# Altium project ESC_Project.PrjPcb
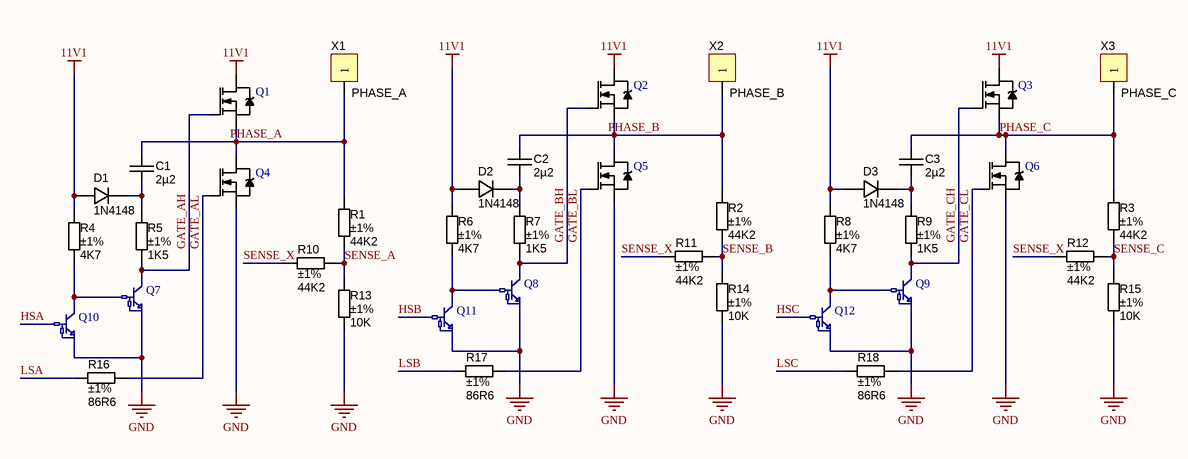
[diagram p0: ESC_Schematic_0.SchDoc]
2 sheets, 71 parts. Net scope: global (net labels, ports and power ports of the same name join across sheets).
Board file: ESC_PCB_0.PcbDoc
Sheets:
  ESC_Schematic_0.SchDoc
  ESC_Schematic_1.SchDoc

## Sheet ESC_Schematic_0.SchDoc
size A

### Parts
C1  value 2µ2  [CAPC2012X135N]  (hidden comment: approved sub OK)
C2  value 2µ2  [CAPC2012X135N]  (hidden comment: approved sub OK)
C3  value 2µ2  [CAPC2012X135N]  (hidden comment: approved sub OK)
D1  1N4148  [SOD523F]
D2  1N4148  [SOD523F]
D3  1N4148  [SOD523F]
Q1  *  [TO-252_1]  (value not drawn)
Q2  *  [TO-252_1]  (value not drawn)
Q3  *  [TO-252_1]  (value not drawn)
Q4  *  [TO-252_1]  (value not drawn)
Q5  *  [TO-252_1]  (value not drawn)
Q6  *  [TO-252_1]  (value not drawn)
Q7  *  [TO-236]  (value not drawn)
Q8  *  [TO-236]  (value not drawn)
Q9  *  [TO-236]  (value not drawn)
Q10  *  [TO-236]  (value not drawn)
Q11  *  [TO-236]  (value not drawn)
Q12  *  [TO-236]  (value not drawn)
R1  value 44K2  Tolerance: ±1%  [RESC2012X70N]  (hidden comment: Thick Film)
R2  value 44K2  Tolerance: ±1%  [RESC2012X70N]  (hidden comment: Thick Film)
R3  value 44K2  Tolerance: ±1%  [RESC2012X70N]  (hidden comment: Thick Film)
R4  value 4K7  Tolerance: ±1%  [RESC2012X70N]  (hidden comment: Thick Film)
R5  value 1K5  Tolerance: ±1%  [RESC2012X70N]  (hidden comment: Thick Film)
R6  value 4K7  Tolerance: ±1%  [RESC2012X70N]  (hidden comment: Thick Film)
R7  value 1K5  Tolerance: ±1%  [RESC2012X70N]  (hidden comment: Thick Film)
R8  value 4K7  Tolerance: ±1%  [RESC2012X70N]  (hidden comment: Thick Film)
R9  value 1K5  Tolerance: ±1%  [RESC2012X70N]  (hidden comment: Thick Film)
R10  value 44K2  Tolerance: ±1%  [RESC2012X70N]  (hidden comment: Thick Film)
R11  value 44K2  Tolerance: ±1%  [RESC2012X70N]  (hidden comment: Thick Film)
R12  value 44K2  Tolerance: ±1%  [RESC2012X70N]  (hidden comment: Thick Film)
R13  value 10K  Tolerance: ±1%  [RESC2012X70N]  (hidden comment: Thick Film)
R14  value 10K  Tolerance: ±1%  [RESC2012X70N]  (hidden comment: Thick Film)
R15  value 10K  Tolerance: ±1%  [RESC2012X70N]  (hidden comment: Thick Film)
R16  value 86R6  Tolerance: ±1%  [RESC2012X70N]  (hidden comment: Thick Film)
R17  value 86R6  Tolerance: ±1%  [RESC2012X70N]  (hidden comment: Thick Film)
R18  value 86R6  Tolerance: ±1%  [RESC2012X70N]  (hidden comment: Thick Film)
X1  PHASE_A  [THP_D38_T75_B125]  (no BOM)
X2  PHASE_B  [THP_D38_T75_B125]  (no BOM)
X3  PHASE_C  [THP_D38_T75_B125]  (no BOM)

### Nets
11V1: D1.A D2.A D3.A Q1.3(D) Q2.3(D) Q3.3(D) R4.1 R6.1 R8.1
GND: Q4.2(S) Q5.2(S) Q6.2(S) Q7.2(E) Q8.2(E) Q9.2(E) Q10.2(E) Q11.2(E) Q12.2(E) R13.2 R14.2 R15.2
GATE_AH: Q1.1(G) Q7.3(C) R5.2
GATE_AL: Q4.1(G) R16.2
GATE_BH: Q2.1(G) Q8.3(C) R7.2
GATE_BL: Q5.1(G) R17.2
GATE_CH: Q3.1(G) Q9.3(C) R9.2
GATE_CL: Q6.1(G) R18.2
HSA: Q10.1(B)
HSB: Q11.1(B)
HSC: Q12.1(B)
LSA: R16.1
LSB: R17.1
LSC: R18.1
PHASE_A: C1.1 Q1.2(S) Q4.3(D) R1.1 X1.1
PHASE_B: C2.1 Q2.2(S) Q5.3(D) R2.1 X2.1
PHASE_C: C3.1 Q3.2(S) Q6.3(D) R3.1 X3.1
SENSE_A: R1.2 R10.2 R13.1
SENSE_B: R2.2 R11.2 R14.1
SENSE_C: R3.2 R12.2 R15.1
SENSE_X: R10.1 R11.1 R12.1
NetC1_2: C1.2 D1.K R5.1
NetC2_2: C2.2 D2.K R7.1
NetC3_2: C3.2 D3.K R9.1
NetQ7_1: Q7.1(B) Q10.3(C) R4.2
NetQ8_1: Q8.1(B) Q11.3(C) R6.2
NetQ9_1: Q9.1(B) Q12.3(C) R8.2

### Library data of the parts
C1-C3 = CAPC_2u2_0805: Capacitor SMD Cer 2.2uF 10% 16V X7R 0805; Manufacturer 1: Kemet; Manufacturer Part Number 1: C0805C225K4RACTU; Ratings: 16V; X7R; SCDType: undef; Supplier 1: Digi-Key; Supplier Part Number 1: 399-3523-1-ND; Tolerance: ±10%; Package / Case: 0805 (2012 metric)
D1-D3 = DIODE_1N4148_200mA_SOD523F: Diode SMD small signal 0.2A SOD-523F; Manufacturer 1: Fairchild Semiconductor; Manufacturer Part Number 1: 1N4148WT; Ratings: Vr=75V; Vf=1V@10mA; Io=200mA; Material: Si; SCDType: source; Package / Case: SC-79, SOD-523F; Supplier 1: Digi-Key; Supplier Part Number 1: 1N4148WTCT-ND; ComponentLink1URL: http://www.fairchildsemi.com/ds/1N/1N914BWT.pdf; ComponentLink1Description: http://www.fairchildsemi.com/ds/1N/1N914BWT.pdf; Value: 1N4148
Q1-Q6 = PHD82N: PHD82N N-Channel MOSFET transistor
Q7-Q12 = PDTC143Z: NPN Resistor-Equipped Transistor (RET)
R1-R3 R10-R12 = RES_44K2_0805_1%: Resistor SMD chip 44.2k Ohm 0.125W 1% 0805; Manufacturer 1: Vishay/Dale; Manufacturer Part Number 1: CRCW080544K2FKEA; Ratings: 1/8W; SCDType: spec; Package / Case: 0805 (2012 metric); Supplier 1: Digi-Key; Supplier Part Number 1: 541-44.2KCCT-ND
R4 R6 R8 = RES_4K7_0805_1%: Resistor SMD chip 4.7k Ohm 0.125W 1% 0805; Manufacturer 1: Vishay/Dale; Manufacturer Part Number 1: CRCW08054K70FKEA; Ratings: 1/8W; SCDType: spec; Package / Case: 0805 (2012 metric); Supplier 1: Digi-Key; Supplier Part Number 1: 541-4.70KCCT-ND
R5 R7 R9 = RES_1K5_0805_1%: Resistor SMD chip 1.5k Ohm 0.125W 1% 0805; Manufacturer 1: Vishay/Dale; Manufacturer Part Number 1: CRCW08051K50FKEA; Ratings: 1/8W; SCDType: spec; Package / Case: 0805 (2012 metric); Supplier 1: Digi-Key; Supplier Part Number 1: 541-1.50KCCT-ND
R13-R15 = RES_10K_0805_1%: Resistor SMD chip 10k Ohm 0.125W 1% 0805; Manufacturer 1: Vishay/Dale; Manufacturer Part Number 1: CRCW080510K0FKEA; Ratings: 1/8W; SCDType: spec; Package / Case: 0805 (2012 metric); Supplier 1: Digi-Key; Supplier Part Number 1: 541-10.0KCCT-ND; Material: Thick Film
R16-R18 = RES_86R6_0805_1%: Resistor SMD chip 86.6 Ohm 0.125W 1% 0805; Manufacturer: Vishay/Dale; Manufacturer Part Number: CRCW080586R6FKEA; Ratings: 1/8W; SCDType: spec; Package / Case: 0805 (2012 metric); Supplier 1: Digi-Key; Supplier Part Number 1: 541-86.6CCT-ND
X1-X3 = Term1

## Sheet ESC_Schematic_1.SchDoc
size A
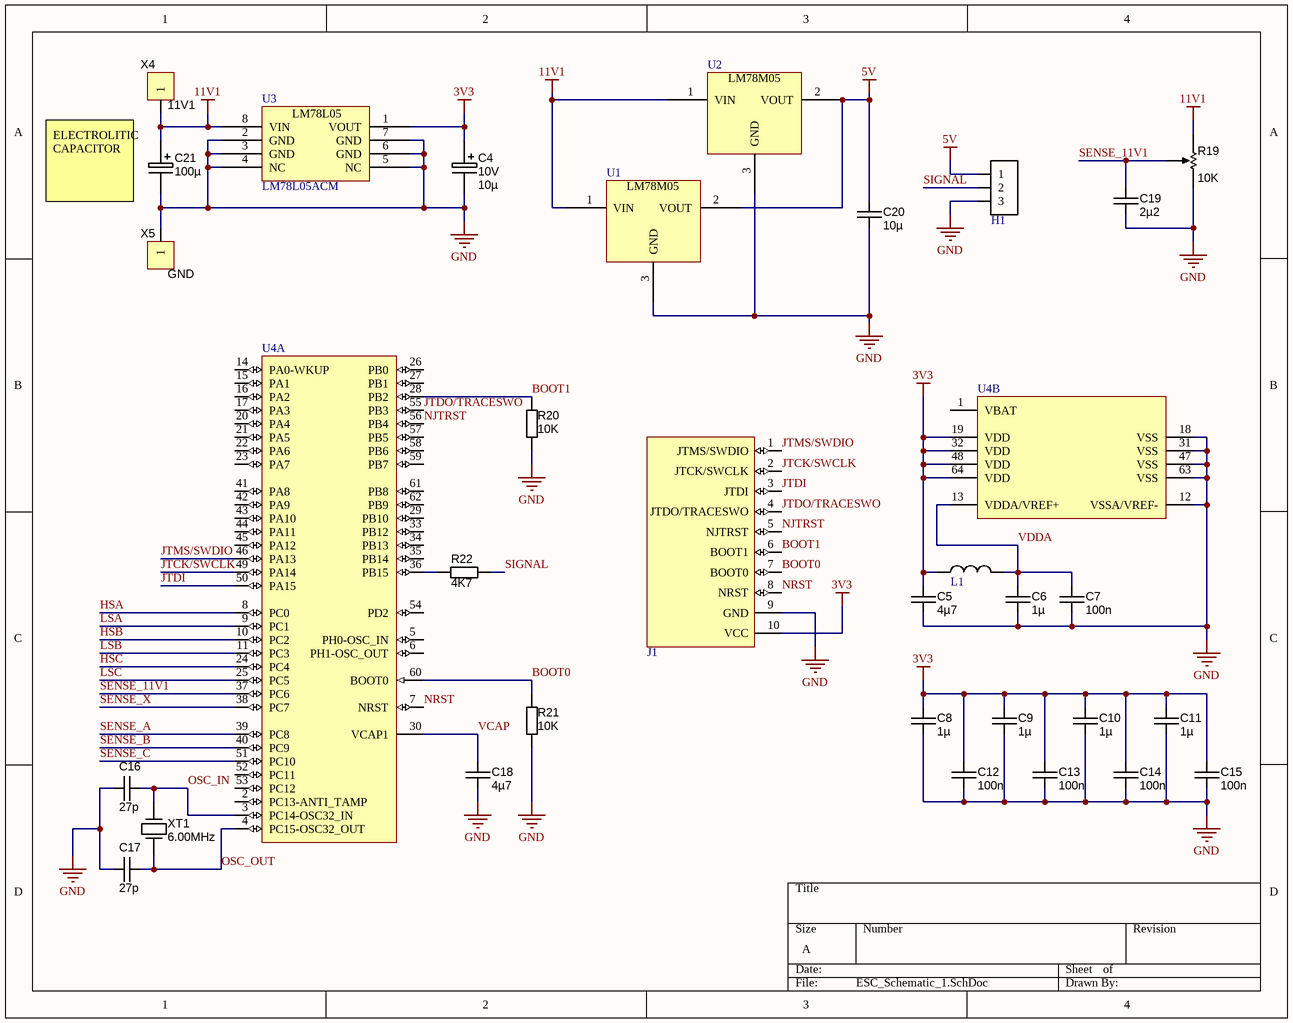
[diagram p1: ESC_Schematic_1.SchDoc]

### Parts
C4  Ratings: 10V  [CAPMP2012X150USR]  (hidden comment: 10µ)
C5  value 4µ7  [CAPC2012X135N]  (hidden comment: approved sub OK)
C6  value 1µ  [CAPC2012X135N]  (hidden comment: approved sub OK)
C7  value 100n  [CAPC2012X135N]  (hidden comment: approved sub OK)
C8  value 1µ  [CAPC2012X135N]  (hidden comment: approved sub OK)
C9  value 1µ  [CAPC2012X135N]  (hidden comment: approved sub OK)
C10  value 1µ  [CAPC2012X135N]  (hidden comment: approved sub OK)
C11  value 1µ  [CAPC2012X135N]  (hidden comment: approved sub OK)
C12  value 100n  [CAPC2012X135N]  (hidden comment: approved sub OK)
C13  value 100n  [CAPC2012X135N]  (hidden comment: approved sub OK)
C14  value 100n  [CAPC2012X135N]  (hidden comment: approved sub OK)
C15  value 100n  [CAPC2012X135N]  (hidden comment: approved sub OK)
C16  value 27p  [CAPC2012X135N]  (hidden comment: approved sub OK)
C17  value 27p  [CAPC2012X135N]  (hidden comment: approved sub OK)
C18  value 4µ7  [CAPC2012X135N]  (hidden comment: approved sub OK)
C19  value 2µ2  [CAPC2012X135N]  (hidden comment: approved sub OK)
C20  value 10µ  [CAPC2012X135N]  (hidden comment: approved sub OK)
C21  100µ  [CAPAE200P550X1200_FLAT2]
H1  *  [HDR_1x3]  (value not drawn)
J1  *  [SWJ-DP connector]  (value not drawn)
L1  *  [INDUCTOR]  (value not drawn)
R19  value 10K  [TrimPot_SMD_Bourns_3214G]  (hidden comment: 5 Turn)
R20  value 10K  [RESC2012X70N]  (hidden comment: Thick Film)
R21  value 10K  [RESC2012X70N]  (hidden comment: Thick Film)
R22  value 4K7  [RESC2012X70N]  (hidden comment: Thick Film)
U1  *  [TO-252]  (value not drawn)
U2  *  [TO-252]  (value not drawn)
U3  LM78L05ACM  [SOIC_8]
U4  (no value)  [STM-LQFP64_N]  (parts A,B of 2)
X4  11V1  [THP_D38_T75_B125]  (no BOM)
X5  GND  [THP_D38_T75_B125]  (no BOM)
XT1  6.00MHz  [CRYSTAL_HC49-US-SM]

### Nets
3V3: C4.1 C5.1 C8.1 C9.1 C10.1 C11.1 C12.1 C13.1 C14.1 C15.1 J1.10(VCC) L1.1 U3.1(VOUT) U4.19(VDD) U4.32(VDD) U4.48(VDD) U4.64(VDD)
5V: C20.1 H1.1 U1.2(VOUT) U2.2(VOUT)
11V1: C21.1 R19.1(CCW) U1.1(VIN) U2.1(VIN) U3.8(VIN) X4.1
GND: C4.2 C5.2 C6.2 C7.2 C8.2 C9.2 C10.2 C11.2 C12.2 C13.2 C14.2 C15.2 C16.1 C17.1 C18.2 C19.2 C20.2 C21.2 H1.3 J1.9(GND) R19.3(CW) R20.2 R21.2 U1.3(GND) U2.3(GND) U3.2(GND) U3.3(GND) U3.4(NC) U3.5(NC) U3.6(GND) U3.7(GND) U4.12(VSSA/VREF-) U4.18(VSS) U4.31(VSS) U4.47(VSS) U4.63(VSS) X5.1
BOOT0: J1.7(BOOT0) R21.1 U4.60(BOOT0)
BOOT1: J1.6(BOOT1) R20.1 U4.28(PB2)
HSA: U4.8(PC0)
HSB: U4.10(PC2)
HSC: U4.24(PC4)
JTCK/SWCLK: J1.2(JTCK/SWCLK) U4.49(PA14)
JTDI: J1.3(JTDI) U4.50(PA15)
JTDO/TRACESWO: J1.4(JTDO/TRACESWO) U4.55(PB3)
JTMS/SWDIO: J1.1(JTMS/SWDIO) U4.46(PA13)
LSA: U4.9(PC1)
LSB: U4.11(PC3)
LSC: U4.25(PC5)
NJTRST: J1.5(NJTRST) U4.56(PB4)
NRST: J1.8(NRST) U4.7(NRST)
OSC_IN: C16.2 U4.3(PC14-OSC32_IN) XT1.2(OUT)
OSC_OUT: C17.2 U4.4(PC15-OSC32_OUT) XT1.1(IN)
SENSE_11V1: C19.1 R19.2(WIPER) U4.37(PC6)
SENSE_A: U4.39(PC8)
SENSE_B: U4.40(PC9)
SENSE_C: U4.51(PC10)
SENSE_X: U4.38(PC7)
SIGNAL: H1.2 R22.2
VCAP: C18.1 U4.30(VCAP1)
VDDA: C6.1 C7.1 L1.2 U4.13(VDDA/VREF+)
NetR22_1: R22.1 U4.36(PB15)

Not connected (* = marked no-connect by the designer): U4 1(VBAT) 2(PC13-ANTI_TAMP) 5(PH0-OSC_IN) 6(PH1-OSC_OUT) 14(PA0-WKUP) 15(PA1) 16(PA2) 17(PA3) 20(PA4) 21(PA5) 22(PA6) 23(PA7) 26(PB0) 27(PB1) 29(PB10) 33(PB12) 34(PB13) 35(PB14) 41(PA8) 42(PA9) 43(PA10) 44(PA11) 45(PA12) 52(PC11) 53(PC12) 54(PD2) 57(PB5) 58(PB6) 59(PB7) 61(PB8) 62(PB9)

### Notes on the sheet
- ELECTROLITIC CAPACITOR
- (in symbol LM78L05ACM) LM78L05
- (in symbol LM78M05CDT) LM78M05

### Library data of the parts
C4 = CAPT_10u_0805_10V: Capacitor SMD Tantalum 10uF 20% 10V 0805; Manufacturer 1: AVX Corporation; Manufacturer Part Number 1: TAJP106M010RNJ; SCDType: spec; Package / Case: 0805 (2012 metric); Tolerance: ±20%; Material: Tantalum; Supplier 1: Digi-Key; Supplier Part Number 1: 478-3281-1-ND; Value: 10µ
C5 C18 = CAPC_4u7_0805: Capacitor SMD Cer 4.7uF 10% 16V X5R 0805; Manufacturer 1: Taiyo Yuden; Manufacturer Part Number 1: EMK212BJ475KG-T; Ratings: 16V; X5R; Material: ceramic; SCDType: spec; Package / Case: 0805 (2012 Metric); Tolerance: ±10%; Supplier 1: Digi-Key; Supplier Part Number 1: 587-1294-1-ND; Operating Temperature: -55°C ~ 85°C; Size / Dimension: 0.079" L x 0.049" W (2.00mm x 1.25mm); Thickness (Max): 0.053" (1.35mm); ComponentLink1URL: http://www.yuden.co.jp/productdata/catalog/en/mlcc01_e.pdf; ComponentLink1Description: http://www.yuden.co.jp/productdata/catalog/en/mlcc01_e.pdf; Supplier 2: Digi-Key; Supplier Part Number 2: 1276-1065-1-ND; Manufacturer 2: Samsung Electro-Mechanics America, Inc; Manufacturer Part Number 2: CL21A475KOFNNNE; RoHS 2: RoHS Compliant; ComponentLink2URL: http://www.samsungsem.com/servlet/FileDownload?type=spec&file=CL21A475KOFNNNE.pdf; ComponentLink2Description: http://www.samsungsem.com/servlet/FileDownload?type=spec&file=CL21A475KOFNNNE.pdf; Supplier 3: Digi-Key; Supplier Part Number 3: 399-8101-1-ND; Manufacturer 3: Kemet; Manufacturer Part Number 3: C0805C475K4PACTU; RoHS 3: RoHS Compliant; ComponentLink3URL: http://capacitoredge.kemet.com/capedge2/DataSheet?pn=C0805C475K4PACTU; ComponentLink3Description: http://capacitoredge.kemet.com/capedge2/DataSheet?pn=C0805C475K4PACTU; Supplier 4: Digi-Key; Supplier Part Number 4: 490-7215-1-ND; Manufacturer 4: Murata Electronics North America; Manufacturer Part Number 4: GRM21BR61C475MA88L; RoHS 4: RoHS Compliant; ComponentLink4URL: http://psearch.murata.com/capacitor/product/GRM21BR61C475MA88#.pdf; ComponentLink4Description: http://psearch.murata.com/capacitor/product/GRM21BR61C475MA88#.pdf; Supplier 5: Digi-Key; Supplier Part Number 5: 445-7640-1-ND; Manufacturer 5: TDK Corporation; Manufacturer Part Number 5: C2012X5R1C475K125AC; RoHS 5: RoHS Compliant; ComponentLink5URL: http://product.tdk.com/capacitor/mlcc/en/documents/mlcc_commercial_general_en.pdf; ComponentLink5Description: http://product.tdk.com/capacitor/mlcc/en/documents/mlcc_commercial_general_en.pdf; RoHS 1: RoHS Compliant
C6 C8-C11 = CAPC_1u_0805_X7R_16V_10%: Capacitor SMD Cer 1uF 10% 16V X7R 0805; Manufacturer 1: Yageo; Manufacturer Part Number 1: CC0805KKX7R7BB105; Ratings: 16V; X7R; Material: ceramic; SCDType: spec; Package / Case: 0805 (2012 metric); Tolerance: ±10%; Supplier 1: Digi-Key; Supplier Part Number 1: 311-1365-6-ND; RoHS 1: RoHS Compliant; Temperature Coefficient: X7R; ComponentLink1URL: http://www.yageo.com/documents/recent/UPY-GPHC_X7R_6.3V-to-50V_8.pdf; ComponentLink1Description: http://www.yageo.com/documents/recent/UPY-GPHC_X7R_6.3V-to-50V_8.pdf; Supplier 2: Digi-Key; Supplier Part Number 2: 399-1284-6-ND; Manufacturer 2: Kemet; Manufacturer Part Number 2: C0805C105K4RACTU; RoHS 2: RoHS Compliant; ComponentLink2URL: http://www.kemet.com/datasheets&C0805C105K4RACTU; ComponentLink2Description: http://www.kemet.com/datasheets&C0805C105K4RACTU; Supplier 3: Digi-Key; Supplier Part Number 3: 1276-1026-6-ND; Manufacturer 3: Samsung Electro-Mechanics America, Inc; Manufacturer Part Number 3: CL21B105KOFNNNE; RoHS 3: RoHS Compliant; ComponentLink3URL: http://www.samsungsem.com/servlet/FileDownload?type=spec&file=CL21B105KOFNNNE.pdf; ComponentLink3Description: http://www.samsungsem.com/servlet/FileDownload?type=spec&file=CL21B105KOFNNNE.pdf; Supplier 4: Digi-Key; Supplier Part Number 4: 445-1358-6-ND; Manufacturer 4: TDK Corporation; Manufacturer Part Number 4: C2012X7R1C105K125AA; RoHS 4: RoHS Compliant; ComponentLink4URL: http://product.tdk.com/capacitor/mlcc/en/documents/mlcc_commercial_general_en.pdf; ComponentLink4Description: http://product.tdk.com/capacitor/mlcc/en/documents/mlcc_commercial_general_en.pdf
C7 C12-C15 = CAPC_100n_0805_X7R_50V_10%: Capacitor SMD Cer 100nF 10% 50V X7R 0805; Manufacturer 1: Kemet; Manufacturer Part Number 1: C0805C104K5RACTU; Ratings: 50V; X7R; Material: ceramic; SCDType: undef; Package / Case: 0805 (2012 metric); Tolerance: ±10%; Supplier 1: Digi-Key; Supplier Part Number 1: 399-1170-1-ND
C16 C17 = CAPC_27p_0805_NP0_50V_5%: Capacitor SMD Cer 27pF 5% 50V NP0 0805; Manufacturer 1: Panasonic - ECG; Manufacturer Part Number 1: ECJ-2VC1H270J; Ratings: 50V; NP0; SCDType: undef; Tolerance: ±5%; Operating Temperature: -55°C ~ 125°C; Package / Case: 0805 (2012 metric); Supplier 1: Digi-Key; Supplier Part Number 1: PCC270CGCT-ND
C19 = CAPC_2u2_0805: as C1 on sheet ESC_Schematic_0; Supplier 1: Digi-Key; Supplier Part Number 1: 399-3523-1-ND; Tolerance: ±10%; Package / Case: 0805 (2012 metric)
C20 = CAPC_10u_0805_16V: Capacitor SMD Cer 10uF 10% 16V X7R 0805; Manufacturer 1: Samsung; Manufacturer Part Number 1: CL21B106KBN; Ratings: 16V; X7R; Material: ceramic; SCDType: undef; Package / Case: 0805 (2012 metric); Tolerance: ±10%
C21 = CAPE_100u_16V_THD: Capacitor THD Electrolytic 100uF 20% 16V Radial; Manufacturer: Panasonic - ECG; Manufacturer Part Number: ECA-1CM101; Material: Aluminum Electrolytic; SCDType: spec; Package / Case: Radial - Through hole; Ratings: 16V; Tolerance: ±20%; Supplier 1: Digi-Key; Supplier Part Number 1: P5138-ND; Value: 100µ
H1 = Header3P: Header, 2-pin
J1 = SWJ-Debug Port: 10 pin Serial Wire JTAG Debug Port
L1 = Inductor: 0603 Inductor
R19 = RES_TRIMMER_10K_5T_SMD: Trimmer SMD 10K 250mW 5-turn Side-adjust; Manufacturer 1: Bourns Inc.; Manufacturer Part Number 1: 3214G-1-103E; Tolerance: 10%; Ratings: 5 turn variable cermet; Number of Turns: 5; SCDType: spec; Supplier 1: Digi-Key; Supplier Part Number 1: 3214G-1-103ECT-ND
R20 R21 = RES_10K_0805_5%: Resistor SMD chip 10k Ohm 0.125W 5% 0805; Manufacturer 1: Yageo; Manufacturer Part Number 1: RC0805JR-0710KL; Ratings: 1/8 W; SCDType: spec; Package / Case: 0805 (2012 metric); Tolerance: ±5%; Material: Thick Film; Supplier 1: Digi-Key; Supplier Part Number 1: 311-10KARCT-ND
R22 = RES_4K7_0805_5%: Resistor SMD chip 4.7k Ohm 0.125W 5% 0805; Manufacturer 1: Yageo; Manufacturer Part Number 1: RC0805JR-074K7L; Ratings: 1/8 W; SCDType: spec; Package / Case: 0805 (2012 metric); Tolerance: ±5%; Material: Thick Film; Supplier 1: Digi-Key; Supplier Part Number 1: 311-4.7KARCT-ND
U1 U2 = LM78M05CDT: LM78L05
U3 = LM78L05ACM: 100-mA Fixed Output Linear Regulator
U4 = STM32F401RBT6: ARM Cortex-M4 32-bit MCU+FPU, 105 DMIPS, 128 kB Flash, 64 kB Internal RAM, 48 I/Os, 64-pin LQFP, -40 to 85 degC, Tray; Manufacturer: STMicroelectronics; FLASH Size (Prog) (kB): 128; I/Os (High Current): 48; Internal RAM Size (kB): 64; Operating Frequency(F) (Processor speed) (MHz): 84; Supply Voltage(Vcc) max (V): 3.6; Supply Voltage(Vcc) min (V): 1.8; DatasheetVersion: Rev. 1; PackageVersion: Rev. 4, 06/2013; PackageReference: LQFP64; PackageDescription: 64-Pin Low Profile Quad Flat Package, 10 x 10 mm Body, 0.5 mm Pitch; Supplier 1: Newark; Supplier Part Number 1: 19X6220; Supplier 2: Mouser; Supplier Part Number 2: 511-STM32F401RBT6; Core: ARM Cortex-M4; Packing: Tray; Mounting Technology: Surface Mount; PartNumber: STM32F401RBT6; ComponentLink1Description: Manufacturer URL; ComponentLink1URL: http://www.st.com/web/en/home.html; ComponentLink2Description: Datasheet; ComponentLink2URL: http://www.st.com/st-web-ui/static/active/en/resource/technical/document/data_brief/DM00071938.pdf; ComponentLink3Description: Package Specification; ComponentLink3URL: http://www.st.com/st-web-ui/static/active/en/resource/technical/document/datasheet/DM00037051.pdf
X4 X5 = Term1
XT1 = Crystal_6MHz_HC49/US: Resonator Ceramic 6.00 MHz 30ppm; Manufacturer 1: CTS-Frequency Controls; Manufacturer Part Number 1: ATS060BSM-1; Frequency: 6MHz; Frequency Stability: ±50ppm; Load Capacitance: 18pF; Operating Mode: Fundamental; Parameter Name: 0.169" (4.30mm); SCDType: spec; Package / Case: HC49/US-SM; Ratings: 6.00 MHz; Supplier 1: Digi-Key; Supplier Part Number 1: CTX882CT-ND; Type: MHz Crystal; Frequency Tolerance: ±30ppm; Operating Temperature: -20°C ~ 70°C; Mounting Type: Surface Mount; Size / Dimension: 0.437" L x 0.190" W (11.10mm x 4.83mm); ComponentLink1URL: http://www.ctscorp.com/components/Datasheets/008-0309-0.pdf; ComponentLink1Description: http://www.ctscorp.com/components/Datasheets/008-0309-0.pdf

## Nets that join several sheets
11V1: ESC_Schematic_0 (9 pins), ESC_Schematic_1 (6 pins)
GND: ESC_Schematic_0 (12 pins), ESC_Schematic_1 (37 pins)
HSA: ESC_Schematic_0 (Q10.1), ESC_Schematic_1 (U4.8)
HSB: ESC_Schematic_0 (Q11.1), ESC_Schematic_1 (U4.10)
HSC: ESC_Schematic_0 (Q12.1), ESC_Schematic_1 (U4.24)
LSA: ESC_Schematic_0 (R16.1), ESC_Schematic_1 (U4.9)
LSB: ESC_Schematic_0 (R17.1), ESC_Schematic_1 (U4.11)
LSC: ESC_Schematic_0 (R18.1), ESC_Schematic_1 (U4.25)
SENSE_A: ESC_Schematic_0 (R1.2 R10.2 R13.1), ESC_Schematic_1 (U4.39)
SENSE_B: ESC_Schematic_0 (R2.2 R11.2 R14.1), ESC_Schematic_1 (U4.40)
SENSE_C: ESC_Schematic_0 (R3.2 R12.2 R15.1), ESC_Schematic_1 (U4.51)
SENSE_X: ESC_Schematic_0 (R10.1 R11.1 R12.1), ESC_Schematic_1 (U4.38)